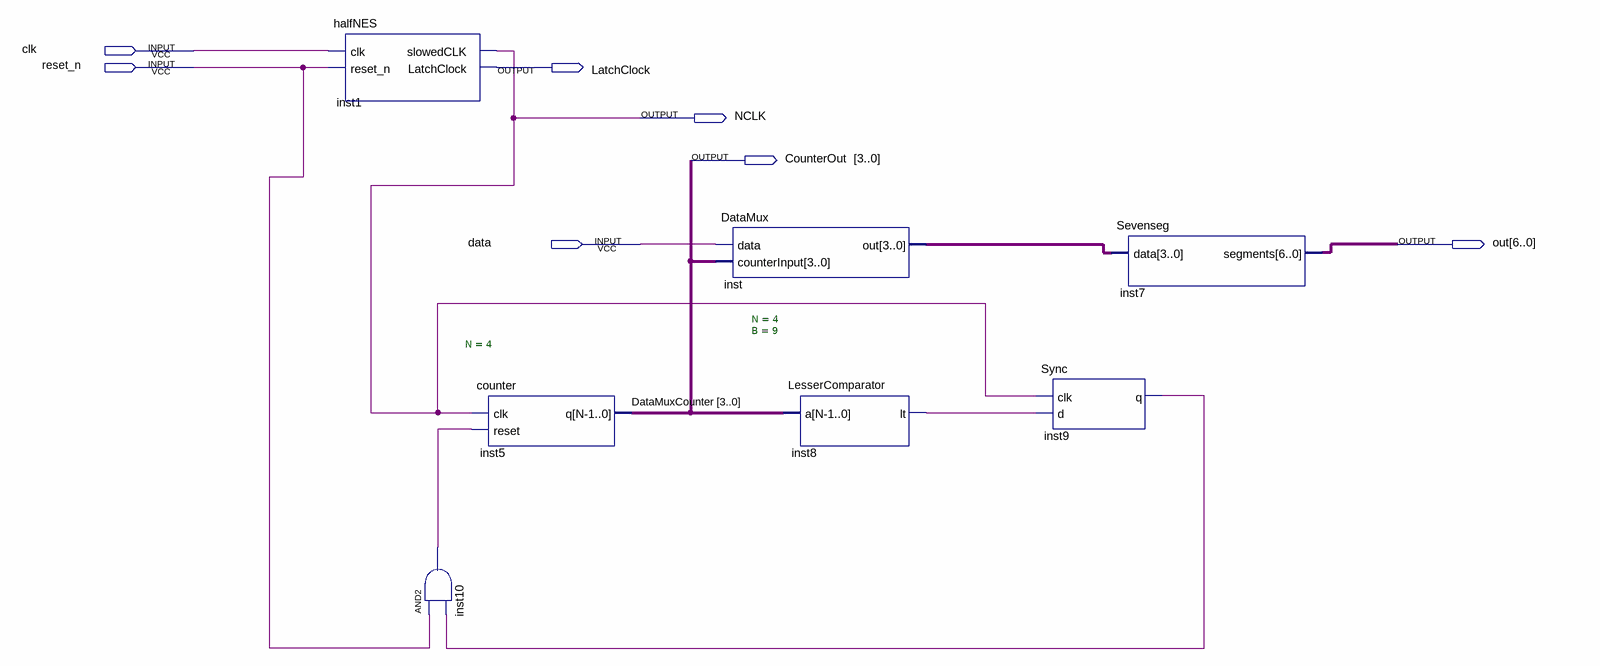
[diagram p0: schematic sheet]
// Quartus schematic NESrecieverwpermission.bdf as structural Verilog: 7 symbols, 7 pins
module NESrecieverwpermission (
  input  clk,
  input  reset_n,
  input  data,
  output LatchClock,
  output NCLK,
  output [3:0] CounterOut,
  output [6:0] out
);

  wire inst8_lt, inst9_q, inst10_out;
  wire [3:0] inst_out;

  halfNES inst1 (.clk(clk), .reset_n(reset_n), .slowedCLK(NCLK), .LatchClock(LatchClock));
  and inst10 (inst10_out, reset_n, inst9_q);
  counter #(.N(4)) inst5 (.clk(NCLK), .reset(inst10_out), .q(CounterOut));
  DataMux inst (.data(data), .counterInput(CounterOut), .out(inst_out));
  LesserComparator #(.N(4), .B(9)) inst8 (.a(CounterOut), .lt(inst8_lt));
  Sync inst9 (.clk(NCLK), .d(inst8_lt), .q(inst9_q));
  Sevenseg inst7 (.data(inst_out), .segments(out));

  // Other names for the same wires on the sheet: DataMuxCounter[3:0] = CounterOut
endmodule
